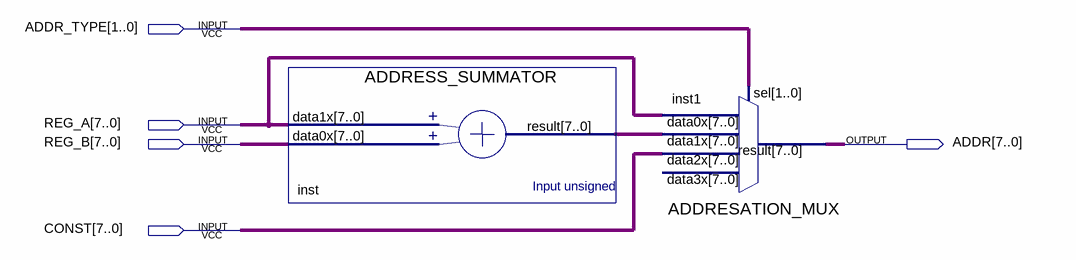
[diagram p0: schematic sheet]
// Quartus schematic ADRESATION.bdf as structural Verilog: 2 symbols, 5 pins
module ADRESATION (
  input  [1:0] ADDR_TYPE,
  input  [7:0] REG_A,
  input  [7:0] REG_B,
  input  [7:0] CONST,
  output [7:0] ADDR
);

  wire [7:0] inst_result;

  ADDRESS_SUMMATOR inst (.data1x(REG_A), .data0x(REG_B), .result(inst_result));
  ADDRESATION_MUX inst1 (
    .data2x(CONST), .data1x(inst_result), .data0x(REG_A), .sel(ADDR_TYPE), .result(ADDR));  // open: data3x
endmodule
